# Altium schematic sheet DSP_DIO.SchDoc: DSP I/O
size A4; Date: 08.04.2017; Author: Jan Petrik; CompanyName: FreeDSP; DrawnBy: Jan Petrik; Organization: FreeDSP; DocumentNumber: 11; Revision: B2; SheetNumber: 11; SheetTotal: 16; email: jan_petrik@centrum.cz; license: CC BY-NC 4.0; PageSetup: Record=PageOptions|CenterHorizontal=True|CenterVertical=True|PrintScale=0.97|XCorrection=1.00|YCorrection=1.00|PrintKind=2|BorderSize=5000000|LeftOffset=0|BottomOffset=0|Orientation=2|PaperLength=1000|PaperWidth=1000|Scale=100|PaperSource=7|PrintQuality=-3|MediaType=1|DitherType=10|PrintScaleMode=1|PaperKind=A4|PaperIndex=9; drawing number: blablabla; Version1: N/A; Version2: N/A; Version3: N/A; Change1description: N/A; Change2description: N/A; Change3description: N/A; Change1DrawnBy: N/A; Change2DrawnBy: N/A; Change3DrawnBy: N/A; Change1CheckedBy: N/A; Change2CheckedBy: N/A; Change3CheckedBy: N/A; PreviusVersion_Chng1: N/A; PreviusVersion_Chng2: N/A; PreviusVersion_Chng3: N/A; Variant1description: Standard assembly; Variant2description: N/A; Variant3description: N/A; Variant4description: N/A
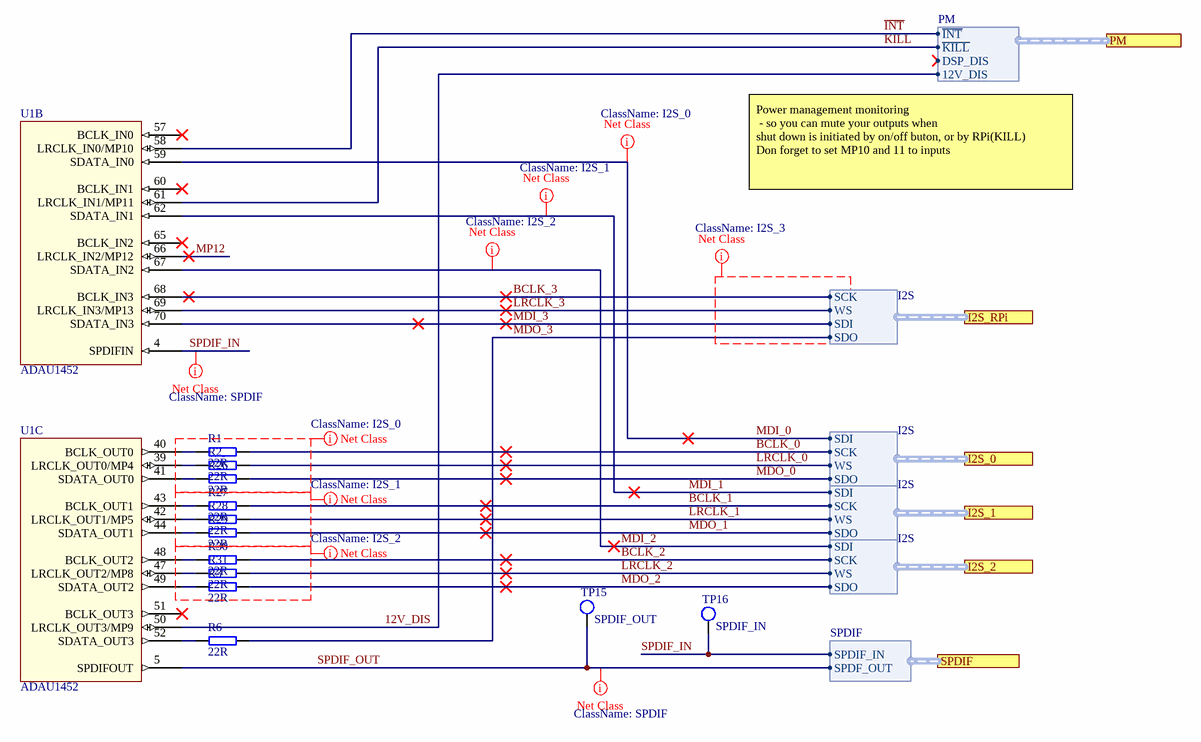
[diagram p0: DSP_DIO.SchDoc]

## Parts
R1  22R  [RESC1608X06N(SMR0603)]
R2  22R  [RESC1608X06N(SMR0603)]
R3  22R  [RESC1608X06N(SMR0603)]
R6  22R  [RESC1608X06N(SMR0603)]
R26  22R  [RESC1608X06N(SMR0603)]
R27  22R  [RESC1608X06N(SMR0603)]
R28  22R  [RESC1608X06N(SMR0603)]
R29  22R  [RESC1608X06N(SMR0603)]
R30  22R  [RESC1608X06N(SMR0603)]
R31  22R  [RESC1608X06N(SMR0603)]
TP15  SPDIF_OUT  [TP_0.8/0.4_ROUND]  (no BOM)
TP16  SPDIF_IN  [TP_0.8/0.4_ROUND]  (no BOM)
U1  ADAU1452  [CP_72_6-handsoldering]  (parts B,C of 6)

## Ports
I2S_0 (harness I2S), I2S_1 (harness I2S), I2S_2 (harness I2S), I2S_RPi (harness I2S), PM (harness PM), SPDIF (harness SPDIF)

## Harnesses
I2S: SDI, WS, SCK, SDO
PM: ~{INT}, ~{KILL}, DSP_DIS, 12V_DIS
SPDIF: SPDIF_IN, SPDF_OUT

## Nets
12V_DIS: U1.50(LRCLK_OUT3/MP9) ; port PM.12V_DIS
BCLK_0: R1.1 ; port I2S_0.SCK
BCLK_1: R27.1 ; port I2S_1.SCK
BCLK_2: R30.1 ; port I2S_2.SCK
BCLK_3: U1.68(BCLK_IN3) ; port I2S_RPi.SCK
~{INT}: U1.58(LRCLK_IN0/MP10) ; port PM.~{INT}
~{KILL}: U1.61(LRCLK_IN1/MP11) ; port PM.~{KILL}
LRCLK_0: R2.1 ; port I2S_0.WS
LRCLK_1: R28.1 ; port I2S_1.WS
LRCLK_2: R31.1 ; port I2S_2.WS
LRCLK_3: U1.69(LRCLK_IN3/MP13) ; port I2S_RPi.WS
MDI_0: U1.59(SDATA_IN0) ; port I2S_0.SDI
MDI_1: U1.62(SDATA_IN1) ; port I2S_1.SDI
MDI_2: U1.67(SDATA_IN2) ; port I2S_2.SDI
MDI_3: U1.70(SDATA_IN3) ; port I2S_RPi.SDI
MDO_0: R26.1 ; port I2S_0.SDO
MDO_1: R29.1 ; port I2S_1.SDO
MDO_2: R3.1 ; port I2S_2.SDO
MDO_3: R6.1 ; port I2S_RPi.SDO
MP12: U1.66(LRCLK_IN2/MP12)
SPDIF_IN: TP16.1 U1.4(SPDIFIN) ; port SPDIF.SPDIF_IN
SPDIF_OUT: TP15.1 U1.5(SPDIFOUT) ; port SPDIF.SPDF_OUT
NetR1_2: R1.2 U1.40(BCLK_OUT0)
NetR2_2: R2.2 U1.39(LRCLK_OUT0/MP4)
NetR3_2: R3.2 U1.49(SDATA_OUT2)
NetR6_2: R6.2 U1.52(SDATA_OUT3)
NetR26_2: R26.2 U1.41(SDATA_OUT0)
NetR27_2: R27.2 U1.43(BCLK_OUT1)
NetR28_2: R28.2 U1.42(LRCLK_OUT1/MP5)
NetR29_2: R29.2 U1.44(SDATA_OUT1)
NetR30_2: R30.2 U1.48(BCLK_OUT2)
NetR31_2: R31.2 U1.47(LRCLK_OUT2/MP8)

Not connected (* = marked no-connect by the designer): U1 51(BCLK_OUT3)* 57(BCLK_IN0)* 60(BCLK_IN1)* 65(BCLK_IN2)*

## Layout directives
net class I2S_0: (no net found under the mark), MDI_0
net class I2S_1: (no net found under the mark), MDI_1
net class I2S_2: (no net found under the mark), MDI_2
net class I2S_3: (no net found under the mark)
net class SPDIF: SPDIF_IN, SPDIF_OUT

## Notes on the sheet
- Power management monitoring
  - so you can mute your outputs when
  shut down is initiated by on/off buton, or by RPi(KILL)
  Don forget to set MP10 and 11 to inputs
- Designed by:
- Sheet Title:
- Board Revision:
- License:
- Email:
- www.freedsp.cc
- www.pidsp.com
- Date:
- Sheet:
- /

## Library data of the parts
R1-R3 R6 R26-R31 = 22R-100mW-0603-ThickFilm: Chip Resistor; Tolerance & Rating: 1%/0.1W; Signal Integrity: Res; Packare: SMR0603; Value: 22R; Simulation: Res; Author: JP/10.06.2014; SMD: 1; Supplier 1: Mouser; Supplier Part Number 1: 603-RC0603FR-0722RL; Type: Resistor
TP15 TP16 = TEST_POINT_VIA: Testpoint - VIA; Value: 0.65/1.55; SMD: -; ClassName: TP
U1 = ADAU1452: SMD: 1; Supplier 1: Mouser; Supplier Part Number 1: 584-ADAU1452WBCPZ